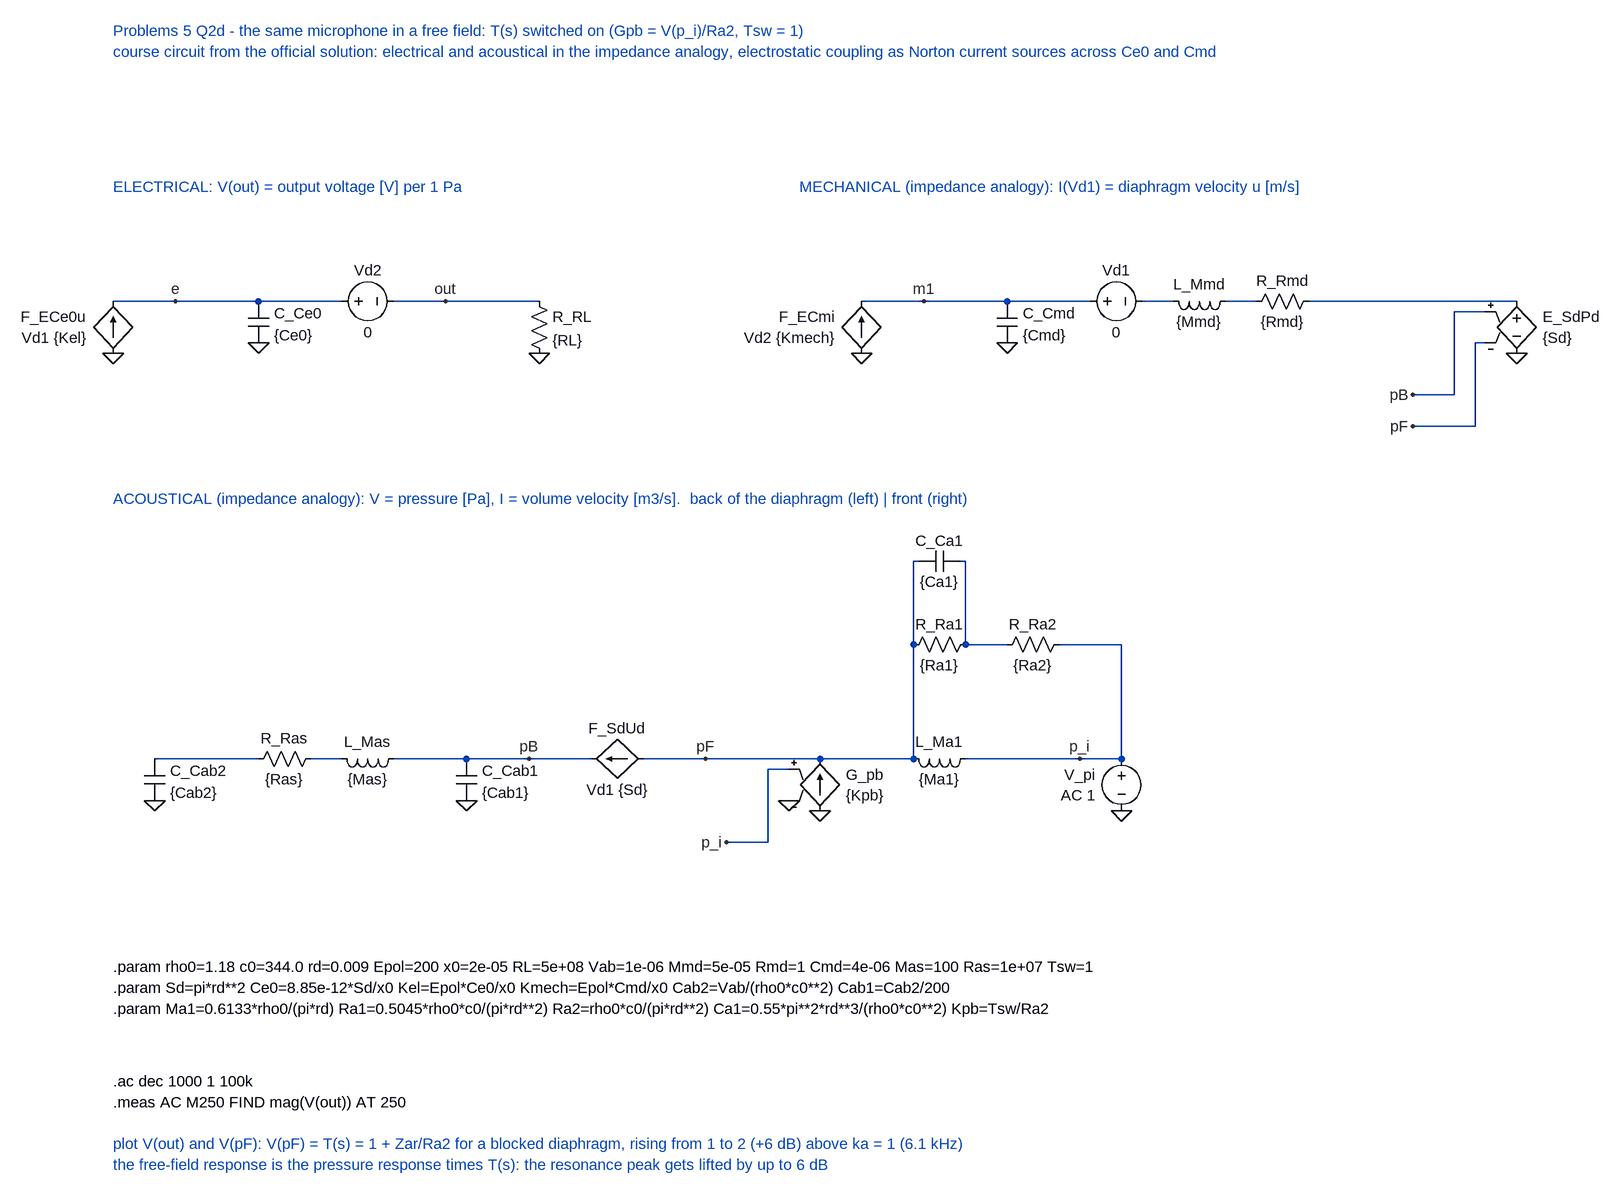
[diagram p0: schematic P5_2d_FreeField.asc]
P5_2d_FreeField.asc, the LTspice schematic file:
Version 4
SHEET 1 3000 1600
WIRE 0 0 352 0
WIRE 432 0 656 0
WIRE 1152 0 1504 0
WIRE 1584 0 1632 0
WIRE 1712 0 1760 0
WIRE 1840 0 2160 0
WIRE 2112 16 2064 16
WIRE 2064 16 2064 144
WIRE 2064 144 2000 144
WIRE 2112 64 2096 64
WIRE 2096 64 2096 192
WIRE 2096 192 2000 192
WIRE 64 704 224 704
WIRE 304 704 352 704
WIRE 432 704 736 704
WIRE 816 704 1232 704
WIRE 1040 720 1008 720
WIRE 1008 720 1008 832
WIRE 1008 832 944 832
WIRE 1312 704 1552 704
WIRE 1232 704 1232 528
WIRE 1232 528 1232 400
WIRE 1232 400 1240 400
WIRE 1304 400 1312 400
WIRE 1312 400 1312 528
WIRE 1312 528 1376 528
WIRE 1456 528 1552 528
WIRE 1552 528 1552 704
FLAG 0 80 0
FLAG 96 0 e
FLAG 224 64 0
FLAG 512 0 out
FLAG 656 80 0
FLAG 1152 80 0
FLAG 1248 0 m1
FLAG 1376 64 0
FLAG 2160 80 0
FLAG 2000 144 pB
FLAG 2000 192 pF
FLAG 64 768 0
FLAG 544 768 0
FLAG 640 704 pB
FLAG 912 704 pF
FLAG 1088 784 0
FLAG 1040 768 0
FLAG 944 832 p_i
FLAG 1552 784 0
FLAG 1488 704 p_i
SYMBOL f 0 80 R180
WINDOW 0 40 56 Left 2
WINDOW 3 40 24 Left 2
SYMATTR InstName F_ECe0u
SYMATTR Value Vd1 {Kel}
SYMBOL cap 208 0 R0
WINDOW 0 40 18 Left 2
WINDOW 3 40 52 Left 2
SYMATTR InstName C_Ce0
SYMATTR Value {Ce0}
SYMBOL voltage 336 0 R270
WINDOW 0 32 56 VTop 2
WINDOW 3 -32 56 VBottom 2
SYMATTR InstName Vd2
SYMATTR Value 0
SYMBOL res 640 -16 R0
SYMATTR InstName R_RL
SYMATTR Value {RL}
SYMBOL f 1152 80 R180
WINDOW 0 40 56 Left 2
WINDOW 3 40 24 Left 2
SYMATTR InstName F_ECmi
SYMATTR Value Vd2 {Kmech}
SYMBOL cap 1360 0 R0
WINDOW 0 40 18 Left 2
WINDOW 3 40 52 Left 2
SYMATTR InstName C_Cmd
SYMATTR Value {Cmd}
SYMBOL voltage 1488 0 R270
WINDOW 0 32 56 VTop 2
WINDOW 3 -32 56 VBottom 2
SYMATTR InstName Vd1
SYMATTR Value 0
SYMBOL ind 1728 -16 R90
WINDOW 0 5 56 VBottom 2
WINDOW 3 32 56 VTop 2
SYMATTR InstName L_Mmd
SYMATTR Value {Mmd}
SYMATTR SpiceLine Rser=0
SYMBOL res 1856 -16 R90
WINDOW 0 0 56 VBottom 2
WINDOW 3 32 56 VTop 2
SYMATTR InstName R_Rmd
SYMATTR Value {Rmd}
SYMBOL e 2160 -16 R0
WINDOW 0 40 40 Left 2
WINDOW 3 40 72 Left 2
SYMATTR InstName E_SdPd
SYMATTR Value {Sd}
SYMBOL cap 48 704 R0
WINDOW 0 40 18 Left 2
WINDOW 3 40 52 Left 2
SYMATTR InstName C_Cab2
SYMATTR Value {Cab2}
SYMBOL res 320 688 R90
WINDOW 0 0 56 VBottom 2
WINDOW 3 32 56 VTop 2
SYMATTR InstName R_Ras
SYMATTR Value {Ras}
SYMBOL ind 448 688 R90
WINDOW 0 5 56 VBottom 2
WINDOW 3 32 56 VTop 2
SYMATTR InstName L_Mas
SYMATTR Value {Mas}
SYMATTR SpiceLine Rser=0
SYMBOL cap 528 704 R0
WINDOW 0 40 18 Left 2
WINDOW 3 40 52 Left 2
SYMATTR InstName C_Cab1
SYMATTR Value {Cab1}
SYMBOL f 816 704 R90
WINDOW 0 -32 40 VBottom 2
WINDOW 3 32 40 VTop 2
SYMATTR InstName F_SdUd
SYMATTR Value Vd1 {Sd}
SYMBOL g 1088 688 R0
WINDOW 0 40 40 Left 2
WINDOW 3 40 72 Left 2
SYMATTR InstName G_pb
SYMATTR Value {Kpb}
SYMBOL ind 1328 688 R90
WINDOW 0 5 56 VBottom 2
WINDOW 3 32 56 VTop 2
SYMATTR InstName L_Ma1
SYMATTR Value {Ma1}
SYMATTR SpiceLine Rser=0
SYMBOL voltage 1552 688 R0
WINDOW 0 -40 40 Right 2
WINDOW 3 -40 72 Right 2
SYMATTR InstName V_pi
SYMATTR Value AC 1
SYMBOL res 1328 512 R90
WINDOW 0 0 56 VBottom 2
WINDOW 3 32 56 VTop 2
SYMATTR InstName R_Ra1
SYMATTR Value {Ra1}
SYMBOL cap 1304 384 R90
WINDOW 0 0 32 VBottom 2
WINDOW 3 32 32 VTop 2
SYMATTR InstName C_Ca1
SYMATTR Value {Ca1}
SYMBOL res 1472 512 R90
WINDOW 0 0 56 VBottom 2
WINDOW 3 32 56 VTop 2
SYMATTR InstName R_Ra2
SYMATTR Value {Ra2}
TEXT 0 -416 Left 2 ;Problems 5 Q2d - the same microphone in a free field: T(s) switched on (Gpb = V(p_i)/Ra2, Tsw = 1)
TEXT 0 -384 Left 2 ;course circuit from the official solution: electrical and acoustical in the impedance analogy, electrostatic coupling as Norton current sources across Ce0 and Cmd
TEXT 0 -176 Left 2 ;ELECTRICAL: V(out) = output voltage [V] per 1 Pa
TEXT 1056 -176 Left 2 ;MECHANICAL (impedance analogy): I(Vd1) = diaphragm velocity u [m/s]
TEXT 0 304 Left 2 ;ACOUSTICAL (impedance analogy): V = pressure [Pa], I = volume velocity [m3/s].  back of the diaphragm (left) | front (right)
TEXT 0 1024 Left 2 !.param rho0=1.18 c0=344.0 rd=0.009 Epol=200 x0=2e-05 RL=5e+08 Vab=1e-06 Mmd=5e-05 Rmd=1 Cmd=4e-06 Mas=100 Ras=1e+07 Tsw=1
TEXT 0 1056 Left 2 !.param Sd=pi*rd**2 Ce0=8.85e-12*Sd/x0 Kel=Epol*Ce0/x0 Kmech=Epol*Cmd/x0 Cab2=Vab/(rho0*c0**2) Cab1=Cab2/200
TEXT 0 1088 Left 2 !.param Ma1=0.6133*rho0/(pi*rd) Ra1=0.5045*rho0*c0/(pi*rd**2) Ra2=rho0*c0/(pi*rd**2) Ca1=0.55*pi**2*rd**3/(rho0*c0**2) Kpb=Tsw/Ra2
TEXT 0 1200 Left 2 !.ac dec 1000 1 100k
TEXT 0 1232 Left 2 !.meas AC M250 FIND mag(V(out)) AT 250
TEXT 0 1296 Left 2 ;plot V(out) and V(pF): V(pF) = T(s) = 1 + Zar/Ra2 for a blocked diaphragm, rising from 1 to 2 (+6 dB) above ka = 1 (6.1 kHz)
TEXT 0 1328 Left 2 ;the free-field response is the pressure response times T(s): the resonance peak gets lifted by up to 6 dB

The netlist it stands for:
* P5_2d_FreeField.asc
F_ECe0u 0 e Vd1 {Kel}
C_Ce0 e 0 {Ce0}
Vd2 e out 0
R_RL out 0 {RL}
F_ECmi 0 m1 Vd2 {Kmech}
C_Cmd m1 0 {Cmd}
Vd1 m1 N001 0
L_Mmd N002 N001 {Mmd} Rser=0
R_Rmd N003 N002 {Rmd}
E_SdPd N003 0 pB pF {Sd}
C_Cab2 N004 0 {Cab2}
R_Ras N005 N004 {Ras}
L_Mas pB N005 {Mas} Rser=0
C_Cab1 pB 0 {Cab1}
F_SdUd pF pB Vd1 {Sd}
G_pb 0 pF p_i 0 {Kpb}
L_Ma1 p_i pF {Ma1} Rser=0
V_pi p_i 0 AC 1
R_Ra1 N006 pF {Ra1}
C_Ca1 N006 pF {Ca1}
R_Ra2 p_i N006 {Ra2}
* Problems 5 Q2d - the same microphone in a free field: T(s) switched on (Gpb = V(p_i)/Ra2, Tsw = 1)
* course circuit from the official solution: electrical and acoustical in the impedance analogy, electrostatic coupling as Norton current sources across Ce0 and Cmd
* ELECTRICAL: V(out) = output voltage [V] per 1 Pa
* MECHANICAL (impedance analogy): I(Vd1) = diaphragm velocity u [m/s]
* ACOUSTICAL (impedance analogy): V = pressure [Pa], I = volume velocity [m3/s].  back of the diaphragm (left) | front (right)
.param rho0=1.18 c0=344.0 rd=0.009 Epol=200 x0=2e-05 RL=5e+08 Vab=1e-06 Mmd=5e-05 Rmd=1 Cmd=4e-06 Mas=100 Ras=1e+07 Tsw=1
.param Sd=pi*rd**2 Ce0=8.85e-12*Sd/x0 Kel=Epol*Ce0/x0 Kmech=Epol*Cmd/x0 Cab2=Vab/(rho0*c0**2) Cab1=Cab2/200
.param Ma1=0.6133*rho0/(pi*rd) Ra1=0.5045*rho0*c0/(pi*rd**2) Ra2=rho0*c0/(pi*rd**2) Ca1=0.55*pi**2*rd**3/(rho0*c0**2) Kpb=Tsw/Ra2
.ac dec 1000 1 100k
.meas AC M250 FIND mag(V(out)) AT 250
* plot V(out) and V(pF): V(pF) = T(s) = 1 + Zar/Ra2 for a blocked diaphragm, rising from 1 to 2 (+6 dB) above ka = 1 (6.1 kHz)
* the free-field response is the pressure response times T(s): the resonance peak gets lifted by up to 6 dB
.backanno
.end